# Altium schematic sheet Heater.SchDoc
size A4
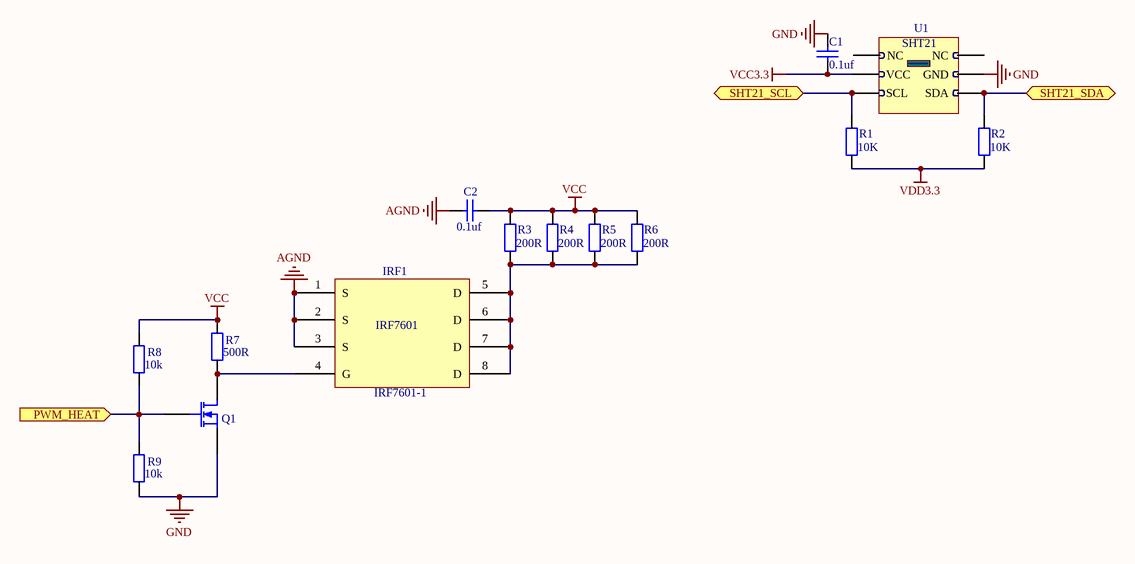
[diagram p0: Heater.SchDoc]

## Parts
C1  value 0.1uf  [0603]  (hidden comment: Capacitor-0603)
C2  value 0.1uf  [0603]  (hidden comment: Capacitor-0603)
IRF1  IRF7601-1  [IRF7601_Micro]
Q1  MOSFET_N  [MOSFET_N]  (value not drawn)
R1  value 10K  [0603]  (hidden comment: Resistor-0603)
R2  value 10K  [0603]  (hidden comment: Resistor-0603)
R3  value 200R  [0805]  (hidden comment: Resistor-0805)
R4  value 200R  [0805]  (hidden comment: Resistor-0805)
R5  value 200R  [0805]  (hidden comment: Resistor-0805)
R6  value 200R  [0805]  (hidden comment: Resistor-0805)
R7  value 500R  [0603]  (hidden comment: Resistor-0603)
R8  value 10k  [0603]  (hidden comment: Resistor-0603)
R9  value 10k  [0603]  (hidden comment: Resistor-0603)
U1  SHIT21  [SHT21]  (value not drawn)

## Ports
PWM_HEAT (in), SHT21_SCL, SHT21_SDA

## Nets
AGND: C2.2 IRF1.1(S) IRF1.2(S) IRF1.3(S)
GND: C1.2 Q1.2(S) R9.1 U1.4(GND)
VCC: C2.1 R3.2 R4.2 R5.2 R6.2 R7.2 R8.2
VCC3.3: C1.1 U1.3(VCC)
VDD3.3: R1.1 R2.1
PWM_HEAT: Q1.1(G) R8.1 R9.2 ; port PWM_HEAT
SHT21_SCL: R1.2 U1.5(SCL) ; port SHT21_SCL
SHT21_SDA: R2.2 U1.6(SDA) ; port SHT21_SDA
NetIRF1_4: IRF1.4(G) Q1.3(D) R7.1
NetIRF1_5: IRF1.5(D) IRF1.6(D) IRF1.7(D) IRF1.8(D) R3.1 R4.1 R5.1 R6.1

Not connected (* = marked no-connect by the designer): U1 1(NC) 2(NC)

## Library data of the parts
IRF1 = Component_1: IRF7601
Q1 = MOSFET_N: Value: AP2306N; Name: MOSFET_N
U1 = SHIT21: Name: SHT21